# EAGLE design phonecard-reader (EAGLE 9.6.2)
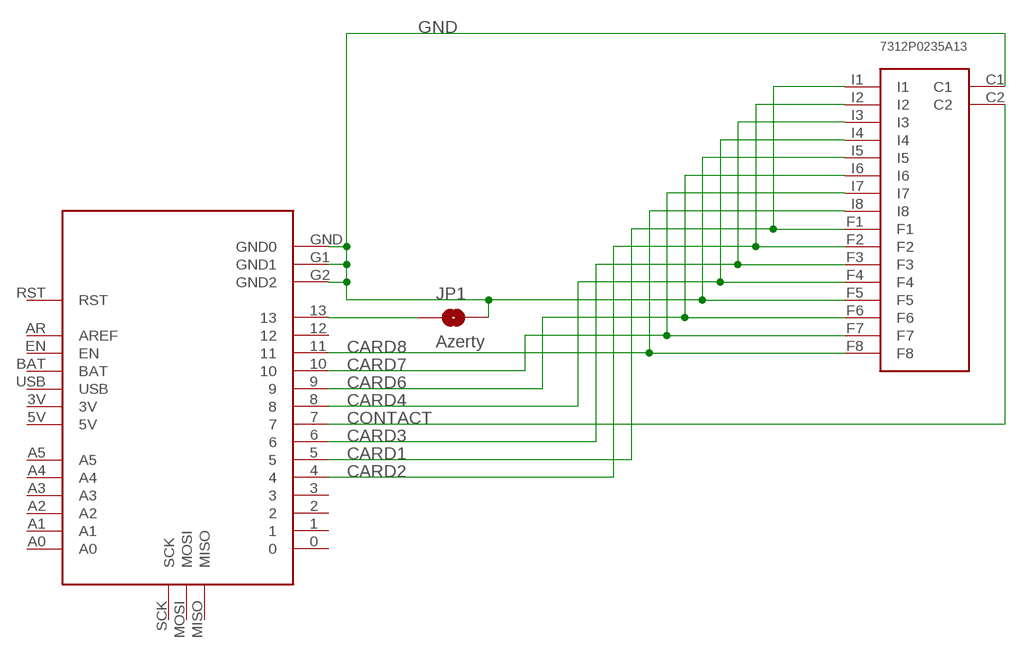
[diagram p0: schematic, sheet 1]

## Parts
JP1  Azerty  JUMPER-SMT_2_NO_SILK_ROUND  [SMT-JUMPER_2_NO_SILK_ROUND]
U$1  Itsy Bitsy 5V  ITSY_BITSY  [ITSY_BITSY_SMD]
U$2  7312P0235A13LFC  [7312P0235A13]

## Nets
CARD1: U$1.5 U$2.F1 U$2.I1
CARD2: U$1.4 U$2.F2 U$2.I2
CARD3: U$1.6 U$2.F3 U$2.I3
CARD4: U$1.8 U$2.F4 U$2.I4
CARD6: U$1.9 U$2.F6 U$2.I6
CARD7: U$1.10 U$2.F7 U$2.I7
CARD8: U$1.11 U$2.F8 U$2.I8
CONTACT: U$1.7 U$2.C2
GND: JP1.2 U$1.G1(GND1) U$1.G2(GND2) U$1.GND(GND0) U$2.C1 U$2.F5 U$2.I5
N$1: JP1.1 U$1.13
Unconnected: U$1.0 U$1.1 U$1.2 U$1.3 U$1.3V U$1.5V U$1.12 U$1.A0 U$1.A1 U$1.A2 U$1.A3 U$1.A4 U$1.A5 U$1.AR(AREF) U$1.BAT U$1.EN U$1.MISO U$1.MOSI U$1.RST U$1.SCK U$1.USB

## Library data of the parts
JP1 = SparkFun-Jumpers:JUMPER-SMT_2_NO: Normally open jumper This jumper has two pads in close proximity to each other. Apply solder to close the connection. Round pads are easier to solder for beginners, but are a lot larger. SparkFun Product that uses the round pads: SparkFun EL Sequencer <https://www.sparkfun.com/products/12781>
U$1 = mylibrary:ITSY_BITSY
U$2 = mylibrary:7312P0235A13LFC

## Board
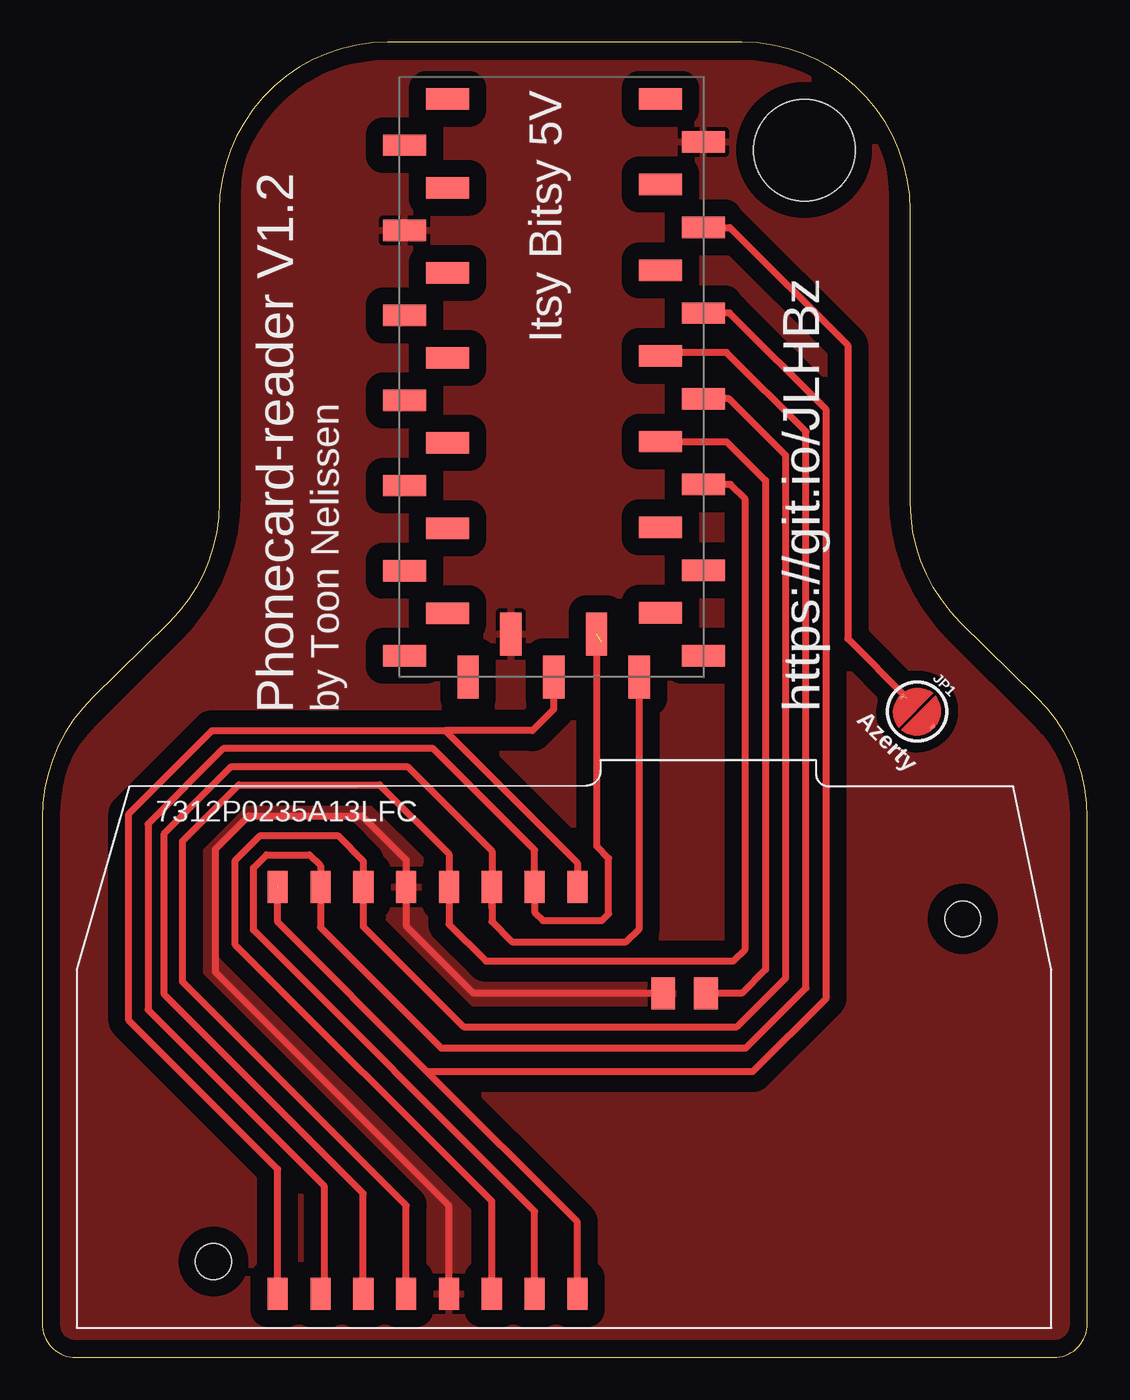
[diagram p1: board, top side]

Size 62 x 78 mm. Coordinates in mm from the lower left corner, seen from the top.
Outline: 0,32 0,2 arc90 2,0 60,0 arc90 62,2 62,32 arc46 59,39.14 54.5,43.56 arc-46 51.5,50.7 51.5,68 arc90 41.5,78 20.5,78 arc90 10.5,68 10.5,50.7 arc-46 7.5,43.56 3,39.14 arc46 0,32
Copper layers (1*16): Top 0.035mm / dielectric 1.5mm / Bottom 0.035mm
Design rules "default": minimum track width 6mil, minimum drill 0.35mm, track to track 6mil, track to pad 6mil, pad to pad 6mil, via to via 6mil, smd to smd 6mil, copper to edge 40mil, drill to drill 6mil, minimum pad ring 10mil, minimum via ring 8mil, stop-mask expansion 4mil, vias tented up to drill 0mil, thermal gap 10mil
Holes 6 mm at 45.2,71.6

### Footprints (pad centres in the part's own frame; a part is rotated, then mirrored left to right if it is on the bottom)
SMT-JUMPER_2_NO_SILK_ROUND = smd 0.152 x 0.305: 1 -1.27,0; 2 1.27,0
ITSY_BITSY_SMD = smd 1.27 x 2.55: 0 0,-1.275; 1 2.54,1.275; 2 5.08,-1.275; 3 7.62,1.275; 3V 0,16.475; 5 10.16,-1.275; 5V 30.277,16.475; 7 12.7,1.275; 9 15.24,-1.275; 10 17.78,1.275; 11 20.32,-1.275; 12 22.86,1.275; 13 25.4,-1.275; A0 22.708,13.925; A1 20.185,16.475; A2 17.662,13.925; A3 15.138,16.475; A4 12.615,13.925; A5 10.092,16.475; AR 27.754,13.925; BAT 33.02,1.275; G1 30.48,-1.275; GND 25.231,16.475; MISO 2.523,13.925; MOSI 5.046,16.475; RST 33.02,13.925; SCK 7.569,13.925; USB 27.94,1.275 | smd 2.55 x 1.27: 4 -1.275,2.54; 6 1.275,5.08; 8 -1.275,7.62; EN -1.275,12.7; G2 1.275,10.16
7312P0235A13 = smd 1.4 x 1.9: C1 -17.78,-4.41; C2 -15.24,-4.41 | smd 1.2 x 1.9: F1 -33.02,-22.24; F2 -35.56,-22.24; F3 -38.1,-22.24; F4 -40.64,-22.24; F5 -33.02,1.89; F6 -35.56,1.89; F7 -38.1,1.89; F8 -40.64,1.89; I1 -30.48,1.89; I2 -27.94,1.89; I3 -25.4,1.89; I4 -22.86,1.89; I5 -30.48,-22.24; I6 -27.94,-22.24; I7 -25.4,-22.24; I8 -22.86,-22.24 | hole 2.1: 0,0; -44.45,-20.32

### Placement (x,y rotation side)
JP1  51.9,38.3 315 top
U$1  37.96,41.61 90 top
U$2  54.61,26 0 top

### Tracks (layer width: path | path; a pad name or v marks a point on that pad's centre or on a via)
CARD1
  Top 0.406: U$2.F1 21.59,9.01 8.32,22.28 8.32,30.62 11.66,33.96 20.02,33.96 24.13,29.85 U$2.I1 24.13,25.69 26.32,23.5 41,23.5 41.7,24.2 41.7,50.9 40.83,51.77 U$1.5
CARD2
  Top 0.406: U$2.F2 19.05,9.72 7.25,21.52 7.25,31.06 11.22,35.03 21.66,35.03 26.67,30.02 U$2.I2 | 26.67,26.67 U$2.I2 | U$2.I2 26.67,25.84 27.87,24.64 34.64,24.64 35.42,25.42 U$1.4
CARD3  (1 unrouted)
  Top 0.406: U$2.F3 16.71,3.96 16.71,10.18 6.28,20.61 6.28,31.63 10.75,36.1 23.2,36.1 29.21,30.09 U$2.I3 29.21,26.39 29.7,25.9 33.2,25.9 33.6,26.3 33.6,29.6 32.9,30.3 32.9,42.1 33.2,42.4
CARD4
  Top 0.406: U$2.F4 13.97,11.16 5.14,19.99 5.14,32.23 10.08,37.17 23.89,37.17 | 23.89,37.17 31.75,29.31 U$2.I4 31.85,27.79 31.85,27.27 | U$1.8 30.34,38.44 29.07,37.17 23.89,37.17
CARD6
  Top 0.406: U$2.I6 26.67,9.26 11.46,24.47 11.46,29.48 12.93,30.95 17.54,30.95 19.05,29.44 U$2.F6 19.05,25.55 25,19.6 41.2,19.6 44.1,22.5 44.1,53.48 40.73,56.85 U$1.9
CARD7
  Top 0.406: U$2.I7 29.21,8.66 12.53,25.34 12.53,29.04 13.3,29.81 15.86,29.81 16.51,29.16 U$2.F7 16.51,25.5 23.67,18.34 41.73,18.34 45.3,21.91 45.3,54.9 40.6,59.6 36.9,59.6 U$1.10
CARD8  (1 unrouted)
  Top 0.406: 22.84,16.94 31.75,8.03 U$2.I8 31.75,5.26 | 22.84,16.94 13.97,25.81 13.97,27.87 | U$1.11 40.77,61.93 46.5,56.2 46.5,21.3 42.14,16.94 22.84,16.94
CONTACT
  Top 0.406: U$1.7 40.59,54.31 42.9,52 42.9,23 41.49,21.59 U$2.C2
GND
  Top 0.406: U$2.I5 24.13,8.99 10.29,22.83 10.29,30.15 12.26,32.12 18.98,32.12 21.59,29.51 U$2.F5 21.59,25.59 25.59,21.59 U$2.C1
  pour Top (isolate 1.016, rank 4): 3.34,37.34 8.49,42.49 arc45 12,50.97 12,69 arc-90 20,77 42,77 arc-90 50,69 50,50.97 arc45 53.51,42.49 58.66,37.34 arc-45 61,31.69 61,2 arc-90 60,1 2,1 arc-90 1,2 1,31.69 arc-45
N$1  (1 unrouted)
  Top 0.406: U$1.13 40.79,67.01 47.78,60.02 47.78,42.62 51.3,39.1

### Text on the board
tNames: Itsy Bitsy 5V | Phonecard-reader V1.2 | by Toon Nelissen | https://git.io/JLHBz